# EAGLE design CHIP_tzatziffy_v6 (EAGLE 7.6.0)
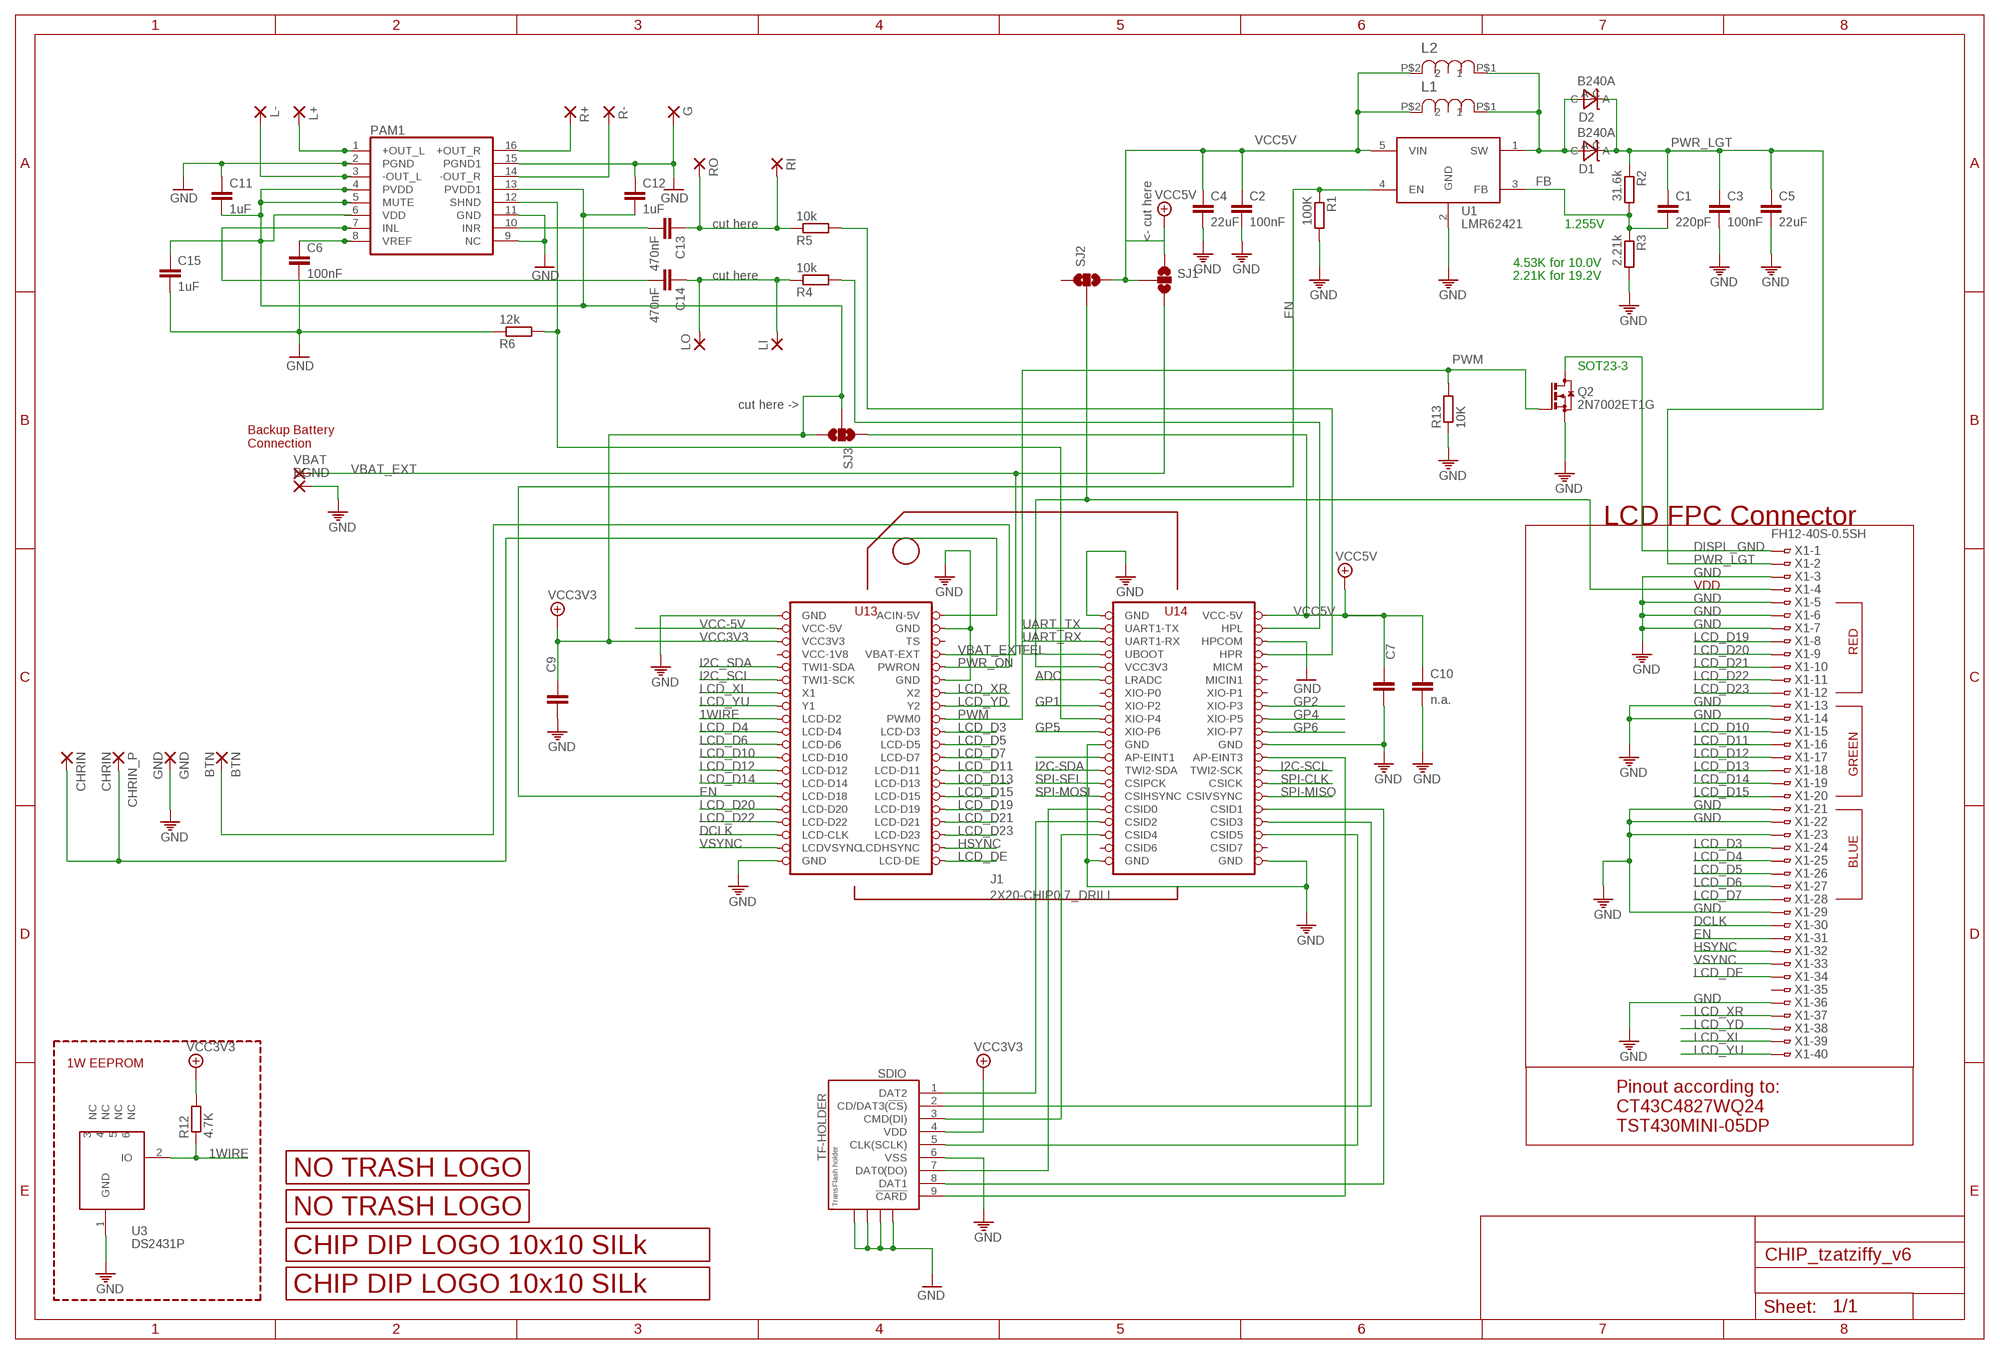
[diagram p0: schematic, sheet 1]

## Parts
BGND  1,6/0,8  [1,6/0,8]
BTN  BTN  SMD5  [SMD2,54-5,08]
C1  220pF  C-EUC0805  [C0805]
C2  100nF  C-EUC0805  [C0805]
C3  100nF  C-EUC0805  [C0805]
C4  22uF  C-EUC1206  [C1206]
C5  22uF  C-EUC1206  [C1206]
C6  100nF  C-EUC0805  [C0805]
C7  n.a.  C-EUC0805  [C0805]
C9  n.a.  C-EUC0805  [C0805]
C10  n.a.  C-EUC0805  [C0805]
C11  1uF  C-EUC0805  [C0805]
C12  1uF  C-EUC0805  [C0805]
C13  470nF  C-EUC0805  [C0805]
C14  470nF  C-EUC0805  [C0805]
C15  1uF  C-EUC0805  [C0805]
CHRIN  1,6/0,8  [1,6/0,8]
CHRIN_P  CHRIN  SMD5  [SMD2,54-5,08]
D1  B240A  DIODE_SCHTKY_B240  [DO-214AC]
D2  B240A  DIODE_SCHTKY_B240  [DO-214AC]
G  1,6/0,8  [1,6/0,8]
GND  GND  SMD5  [SMD2,54-5,08]
J1  2X20-CHIP0.7_DRILL  [2X20CHIP_NOOFFSET-TH_0.7]
L1  SRN6045-100M  [SRN6045]
L2  SRN6045-100M  [SRN6045]
L+  1,6/0,8  [1,6/0,8]
L-  1,6/0,8  [1,6/0,8]
LI  1,6/0,8  [1,6/0,8]
LO  1,6/0,8  [1,6/0,8]
PAM1  PAM8403  [SOP-16]
Q2  2N7002ET1G  BSS123  [SOT23]
R1  100K  R-EU_M0805  [M0805]
R2  31.6k  R-EU_M0805  [M0805]
R3  2.21k  R-EU_M0805  [M0805]
R4  10k  R-EU_R0805  [R0805]
R5  10k  R-EU_R0805  [R0805]
R6  12k  R-EU_R0805  [R0805]
R12  4.7K  R-EU_M0805  [M0805]
R13  10K  R-EU_M0805  [M0805]
R+  1,6/0,8  [1,6/0,8]
R-  1,6/0,8  [1,6/0,8]
RI  1,6/0,8  [1,6/0,8]
RO  1,6/0,8  [1,6/0,8]
SDIO  TF-HOLDER  [TF-PULL]
SJ1  SOLDERJUMPER_2WAYT  [SJ_2]
SJ2  SOLDERJUMPER_2WAYT  [SJ_2]
SJ3  SOLDERJUMPER_2WAYT  [SJ_2]
U1  LMR62421  [SOT23-5]
U3  DS2431P  [TSOC6]
U$2  LOGO_10X10_SILK  [LOGO2_10X10_SILK]
U$3  LOGO_NO_TRASHROHS  [LOGO_ROHS_SYM]
U$4  LOGO_NO_TRASHNO_TRASH  [LOGO_ROHS_NO_TRASH]
U$5  LOGO_10X10_SILK  [LOGO2_10X10_SILK]
VBAT  1,6/0,8  [1,6/0,8]
X1  FH12-40S-0.5SH  [FH12-40S-0.5SH]

## Nets
1WIRE: J1.LCD-D2 R12.1 U3.2(IO)
ADC: J1.LRADC
DCLK: J1.LCD-CLK X1.30
DISPL_GND: Q2.3(D) X1.1
EN: J1.LCD-D18 R1.1 U1.4(EN) X1.31
FB: C1.2 R2.2 R3.1 U1.3(FB)
FEL: J1.FEL(UBOOT)
GND: BGND.1(P) C2.2 C3.2 C4.2 C5.2 C6.2 C7.2 C9.2 C10.2 C11.1 C12.1 C15.2 G.1(P) GND.1(P) J1.GND@1(GND) J1.GND@2(GND) J1.GND@3(GND) J1.GND@4(GND) J1.GND@5(GND) J1.GND@6(GND) J1.GND@7(GND) J1.GND@8(GND) J1.GND@10(GND) J1.HPCOM PAM1.2(PGND) PAM1.9(NC) PAM1.11(GND) PAM1.15(PGND1) Q2.2(S) R1.2 R3.2 R6.1 R13.1 SDIO.6(VSS) SDIO.S1 SDIO.S2 SDIO.S3 SDIO.S4 U1.2(GND) U3.1(GND) X1.3 X1.5 X1.6 X1.7 X1.13 X1.14 X1.21 X1.22 X1.23 X1.29 X1.36
GP1: J1.XIO-P2
GP2: J1.XIO-P3
GP3: J1.XIO-P4 PAM1.12(SHND) R6.2
GP4: J1.XIO-P5
GP5: J1.XIO-P6
GP6: J1.XIO-P7
HSYNC: J1.LCD-HSYNC(LCDHSYNC) X1.32
I2C-SCL: J1.TWI2-SCK
I2C-SDA: J1.TWI2-SDA
I2C_SCL: J1.TWI1-SCK
I2C_SDA: J1.TWI1-SDA
KPD_INT: J1.AP-EINT1
LCD_D3: J1.LCD-D3 X1.24
LCD_D4: J1.LCD-D4 X1.25
LCD_D5: J1.LCD-D5 X1.26
LCD_D6: J1.LCD-D6 X1.27
LCD_D7: J1.LCD-D7 X1.28
LCD_D10: J1.LCD-D10 X1.15
LCD_D11: J1.LCD-D11 X1.16
LCD_D12: J1.LCD-D12 X1.17
LCD_D13: J1.LCD-D13 X1.18
LCD_D14: J1.LCD-D14 X1.19
LCD_D15: J1.LCD-D15 X1.20
LCD_D19: J1.LCD-D19 X1.8
LCD_D20: J1.LCD-D20 X1.9
LCD_D21: J1.LCD-D21 X1.10
LCD_D22: J1.LCD-D22 X1.11
LCD_D23: J1.LCD-D23 X1.12
LCD_DE: J1.LCD-DE X1.34
LCD_XL: J1.X1 X1.39
LCD_XR: J1.X2 X1.37
LCD_YD: J1.Y2 X1.38
LCD_YU: J1.Y1 X1.40
N$1: J1.CSID0 SDIO.7(DAT0(DO))
N$24: CHRIN.1(P) CHRIN_P.1(P) J1.CHG-IN(ACIN-5V)
N$25: J1.CSID4 SDIO.3(CMD(DI))
N$26: J1.VCC3V3@1(VCC3V3) SJ2.2 X1.4
N$27: J1.CSID1 SDIO.8(DAT1)
N$28: J1.CSID3 SDIO.2(CD/DAT3(!CS!))
N$31: J1.CSID2 SDIO.1(DAT2)
N$32: L+.1(P) PAM1.1(+OUT_L)
N$33: L-.1(P) PAM1.3(-OUT_L)
N$34: PAM1.16(+OUT_R) R+.1(P)
N$35: PAM1.14(-OUT_R) R-.1(P)
N$36: C14.2 PAM1.7(INL)
N$37: J1.HPR R5.2
N$38: C6.1 PAM1.8(VREF)
N$39: C13.2 PAM1.10(INR)
N$40: J1.HPL R4.2
N$41: C14.1 LI.1(P) LO.1(P) R4.1
N$43: C13.1 R5.1 RI.1(P) RO.1(P)
N$44: J1.CSID5 SDIO.5(CLK(SCLK))
N$45: J1.AP-EINT3 SDIO.9(!CARD)
PWM: J1.PWM0 Q2.1(G) R13.2
PWR_LGT: C1.1 C3.1 C5.1 D1.C D2.C R2.1 X1.2
PWR_ON: BTN.1(P) J1.PWRON
SPI-CLK: J1.CSICK
SPI-MISO: J1.CSIVSYNC
SPI-MOSI: J1.CSIHSYNC
SPI-SEL: J1.CSIPCK
UART_RX: J1.UART1-RX
UART_TX: J1.UART1-TX
VBAT_EXT: J1.BAT(VBAT-EXT) SJ1.3 VBAT.1(P)
VCC3V3: C9.1 C11.2 C12.2 C15.1 J1.VCC3V3 PAM1.4(PVDD) PAM1.5(MUTE) PAM1.6(VDD) PAM1.13(PVDD1) R12.2 SDIO.4(VDD) SJ3.2 SJ3.3
VCC5V: C2.1 C4.1 C7.1 C10.1 J1.VCC5V@1(VCC-5V) L1.P$2 L2.P$2 SJ1.1 SJ1.2 SJ2.3 SJ3.1 U1.5(VIN)
VCC-5V: J1.VCC5V@0(VCC-5V)
VREG_OUTPUT: D1.A D2.A L1.P$1 L2.P$1 U1.1(SW)
VSYNC: J1.LCD-VSYNC(LCDVSYNC) X1.33
Unconnected: J1.CSID6 J1.CSID7 J1.MICIN1 J1.MICM J1.TS J1.XIO-P0 J1.XIO-P1 SJ2.1 U3.3(NC) U3.4(NC) U3.5(NC) U3.6(NC) X1.35

## Notes on the sheet
- cut here | 1.255V
- <- cut here
- 4.53K for 10.0V
- cut here | 2.21K for 19.2V
- SOT23-3
- cut here ->
- Backup Battery
  Connection
- LCD FPC Connector
- VDD
- RED
- GREEN
- BLUE
- 1W EEPROM
- Pinout according to:
  CT43C4827WQ24
  TST430MINI-05DP

## Power pins joined to a net without a drawn wire
VCC-1V8: J1.VCC1V8(VCC-1V8)

## Library data of the parts
BGND CHRIN G L+ L- LI LO R+ R- RI RO VBAT = wirepad:1,6/0,8: THROUGH-HOLE PAD
BTN CHRIN_P GND = wirepad:SMD5: SMD PAD
C1-C7 C9-C15 = rcl:C-EU: CAPACITOR, European symbol
D1 D2 = Keyboard v0_5:DIODE_SCHTKY_B240; DESCRIPTION: DIODE SMD General Purpose 400V 1A 1.4W RoHS DO-214AC; FOOTPRINT: DO-214AC; LINK: http://www.digikey.com/product-detail/en/B240A-13-F/B240A-FDICT-ND/717810; MFG: DIGIKEY; MFG_PN: B240A-FDICT-ND; PART_TYPE: DIODE; PRICE: 0.11; VENDOR: DIODES; VENDOR_PART_NUMBER: B240A-13-F
J1 = JKW_CHIP:2X20-CHIP: Through hole layout with chip reference
L1 L2 = Keyboard v0_5:SRN6045-100M; DESCRIPTION: power inductor 10uH 2.5A 58.6 mohm; FOOTPRINT: SRN6045; LINK: http://www.digikey.com/product-detail/en/SRN6045-100M/SRN6045-100MTR-ND/2756120; MFG: DIGIKEY; MFG_PN: SRN6045-100MTR-ND; PART_TYPE: IND; PRICE: 0.15; TOLLERANCE: ±20%; VENDOR: BOURNS; VENDOR_PART_NUMBER: SRN6045-100M
PAM1 = JKW_CHIP:PAM8403: Dual channel audio amplifier IC - PAM8403
Q2 = transistor-small-signal:BSS123: N-CHANNEL MOS FET
R1-R6 R12 R13 = rcl:R-EU_: RESISTOR, European symbol
SDIO = JKW_CHIP:TF-HOLDER: TF / Micro SD socket is PUSH-PUSH type, the card can be pushed into and auto locked and pushed out by simply press the card. Surface Mounting type.
SJ1-SJ3 = SparkFun-Retired:SOLDERJUMPER_2WAY: Solder Jumper 2 way solder jumper
U1 = PocketCHIP-Components-v0.7:LMR62421; DESCRIPTION: dc/dc step up, 2.1A, 1.6mhz, SOT-23-5; FOOTPRINT: SOT23-5; LINK: http://www.digikey.com/product-detail/en/LMR62421XMFE%2FNOPB/LMR62421XMFE%2FNOPBCT-ND/2777085; MFG: DIGIKEY; MFG_PN: LMR62421XMFE/NOPBCT-ND; PART_TYPE: IC; PRICE: 0.8; VENDOR: TEXAS INSTRUMENTS; VENDOR_PART_NUMBER: LMR62421XMFE/NOPB
U3 = Keyboard v0_5:DS2431: 1024-Bit EEPROM This chip provides a 4x256 Bit EEPROM, which can be programmed@5V. Write protection and OTP emulation are available, too. Author: Jan Kandziora <jjj@gmx.de>; DESCRIPTION: IC, 1024-Bit, 1-Wire EEPROM, TSOC6; FOOTPRINT: TSOC6; LINK: http://www.digikey.com/product-detail/en/DS2431P%2BT%26R/DS2431P%2BT%26RCT-ND/3647900; MFG: DIGIKEY; MFG_PN: DS2431P+T&RCT-ND; PART_TYPE: IC; PRICE: 0.98; VENDOR: MAXIM; VENDOR_PART_NUMBER: DS2431P+T&R
U$2 U$5 = JKW_CHIP:LOGO_10X10_SILK
U$3 U$4 = JKW_CHIP:LOGO_NO_TRASH
X1 = Keyboard v0_5:FH12-40S-0.5S: 0.5mm Pitch Connectors For FPC/FFC Source: Data sheet <http://www.hirose.co.jp/cataloge_hp/e58605370.pdf>; DESCRIPTION: CON ffc smd, bottom contact 40pos, 0.50mm R/A; FOOTPRINT: FH12-40S-0.5SH; LINK: http://www.digikey.com/product-detail/en/FH12-40S-0.5SH(55)/HFJ140CT-ND/1110388; MFG: DIGIKEY; MFG_PN: HFJ140CT-ND; VENDOR: HIROSE; VENDOR_PART_NUMBER: FH12-40S-0.5SH(55)

## Board
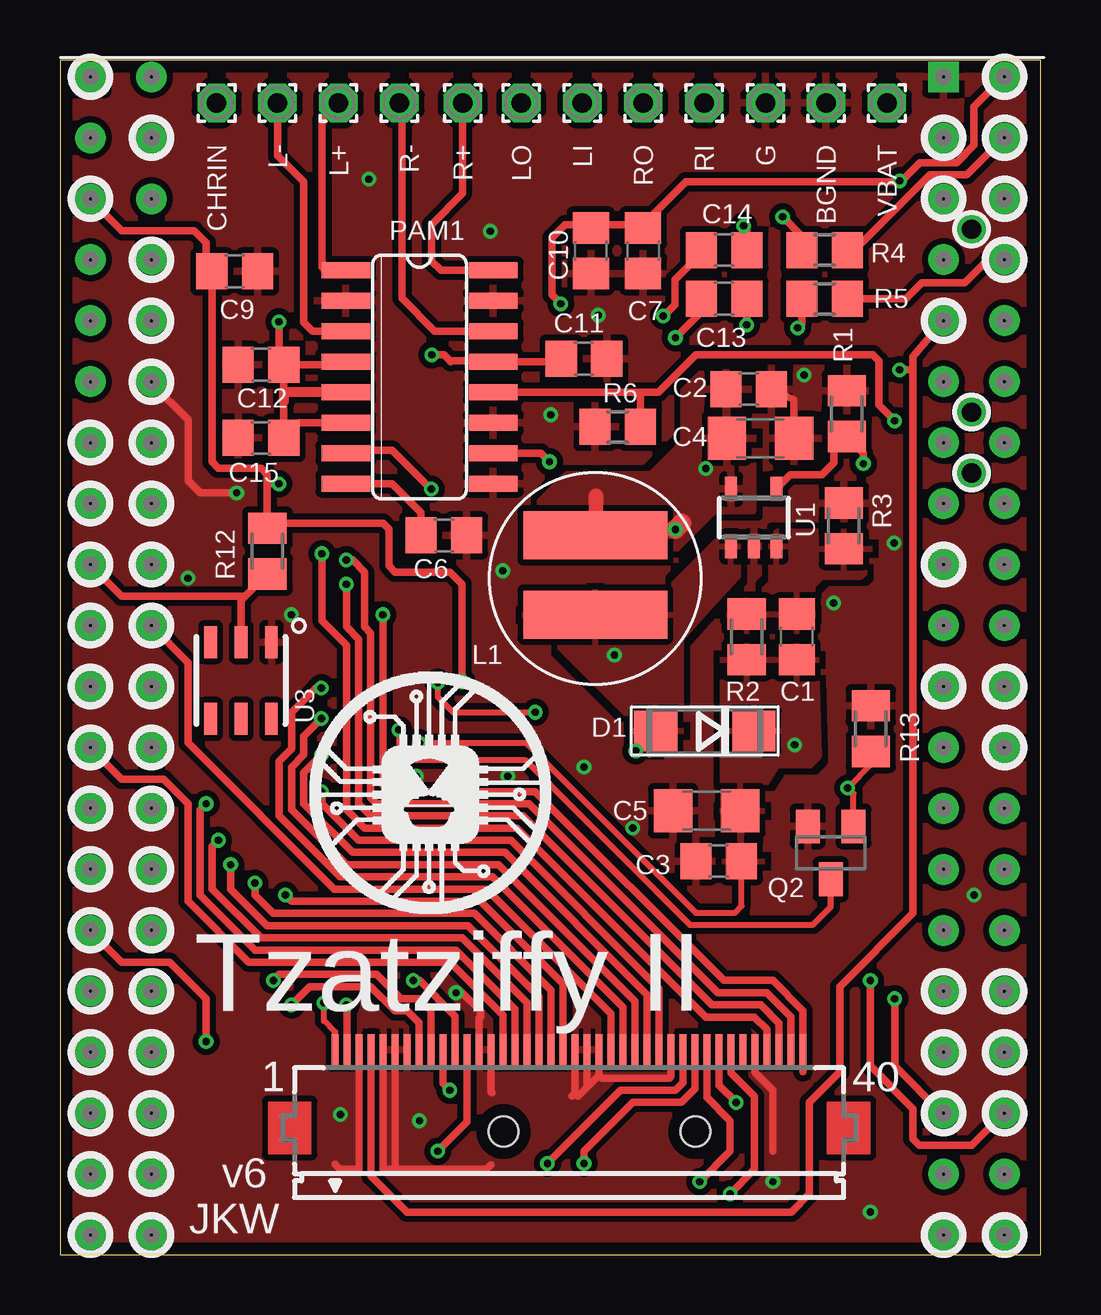
[diagram p1: board, top side]
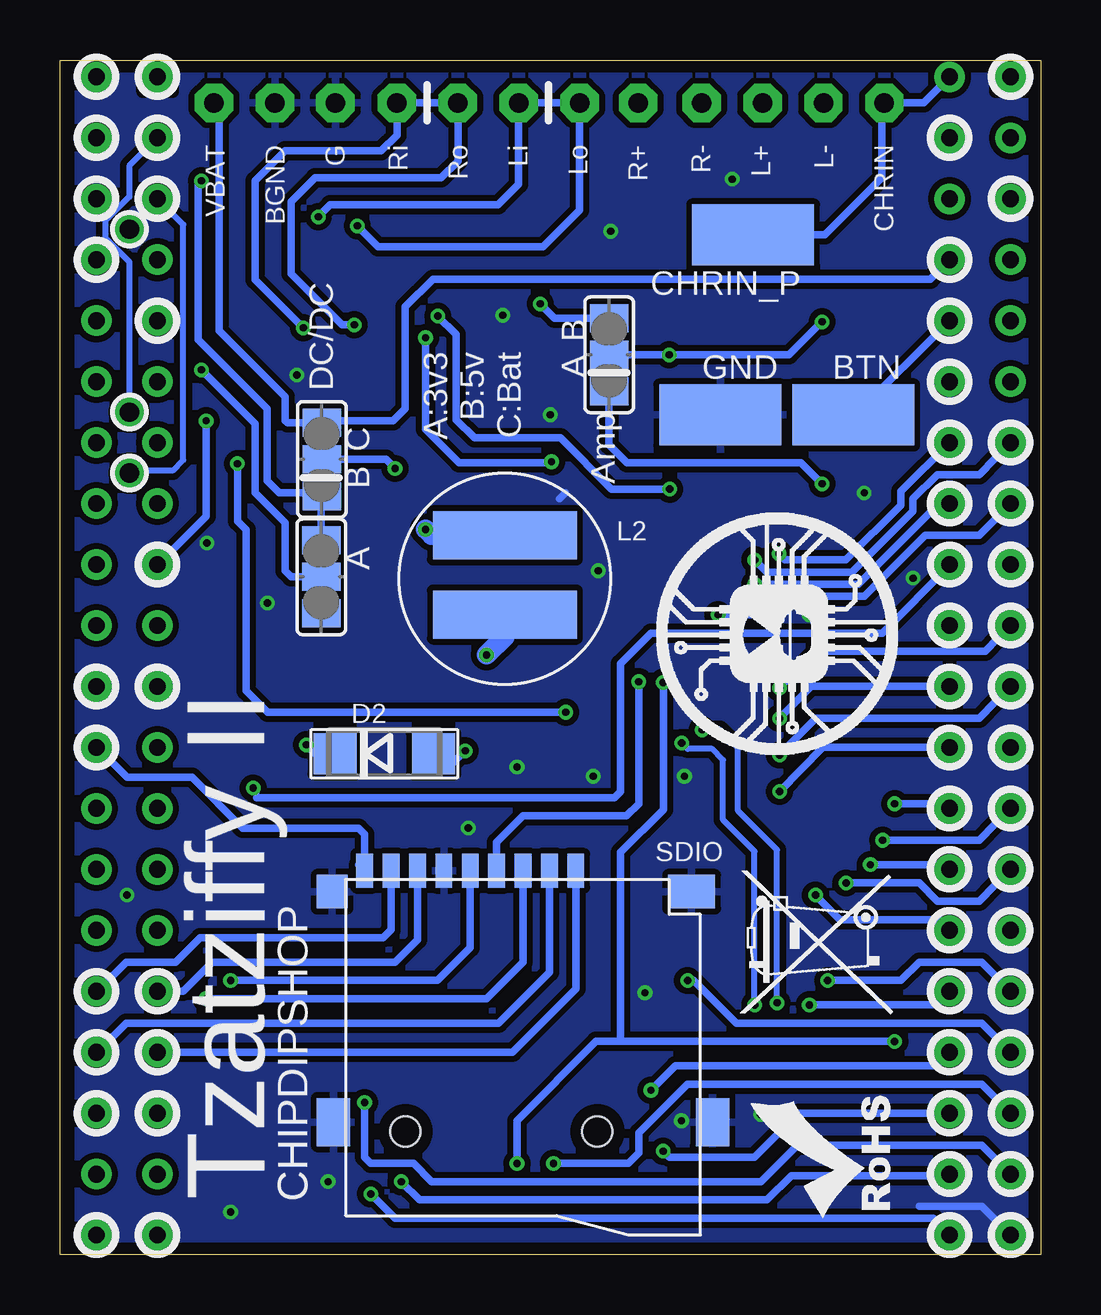
[diagram p2: board, bottom side, seen from below]

Size 40.89 x 49.78 mm. Coordinates in mm from the lower left corner, seen from the top.
Outline: 0,0 40.89,0 40.89,49.78 0,49.78 0,0
Copper layers (1*16): Top 0.035mm / dielectric 1.6mm / Bottom 0.035mm
Design rules "Elecrow_2-layer_PCB_eagle_rule": minimum track width 6mil, minimum drill 12mil, track to track 6mil, track to pad 6mil, pad to pad 6mil, via to via 8mil, smd to smd 0mil, copper to edge 20mil, drill to drill 10mil, minimum pad ring 6mil, minimum via ring 6mil, stop-mask expansion 0mil, vias tented up to drill 100mil, thermal gap 10mil

### Footprints (pad centres in the part's own frame; a part is rotated, then mirrored left to right if it is on the bottom)
1,6/0,8 = drill 0.813 pad 1.6 octagon: 1 0,0
SMD2,54-5,08 = smd 2.54 x 5.08: 1 0,0
C0805 = smd 1.3 x 1.5: 1 -0.95,0; 2 0.95,0
C1206 = smd 1.6 x 1.8: 1 -1.4,0; 2 1.4,0
DO-214AC = smd 1.8 x 1.7: A 2.05,0; C -2.05,0
2X20CHIP_NOOFFSET-TH_0.7 = drill 0.7 pad 1.27: AP-EINT1 15.22,-3.75; AP-EINT3 17.76,-3.75; BAT -17.8,16.57; CHG-IN -17.8,24.19; CSICK 17.76,-8.83; CSID0 15.22,-13.91; CSID1 17.76,-13.91; CSID2 15.22,-16.45; CSID3 17.76,-16.45; CSID4 15.22,-18.99; CSID5 17.76,-18.99; CSID6 15.22,-21.53; CSID7 17.76,-21.53; CSIHSYNC 15.22,-11.37; CSIPCK 15.22,-8.83; CSIVSYNC 17.76,-11.37; FEL 15.22,16.57; GND@1 -17.8,11.49; GND@2 -20.34,-24.07; GND@4 17.76,-1.21; GND@5 17.76,-24.07; GND@6 15.22,-24.07; GND@7 15.22,-1.21; GND@10 -17.8,21.65; HPCOM 17.76,19.11; HPL 17.76,21.65; HPR 17.76,16.57; LCD-CLK -20.34,-18.99; LCD-D2 -20.34,3.87; LCD-D3 -17.8,1.33; LCD-D4 -20.34,1.33; LCD-D5 -17.8,-1.21; LCD-D6 -20.34,-1.21; LCD-D7 -17.8,-3.75; LCD-D10 -20.34,-3.75; LCD-D11 -17.8,-6.29; LCD-D12 -20.34,-6.29; LCD-D13 -17.8,-8.83; LCD-D14 -20.34,-8.83; LCD-D15 -17.8,-11.37; LCD-D18 -20.34,-11.37; LCD-D19 -17.8,-13.91; LCD-D20 -20.34,-13.91; LCD-D21 -17.8,-16.45; LCD-D22 -20.34,-16.45; LCD-D23 -17.8,-18.99; LCD-DE -17.8,-24.07; LCD-HSYNC -17.8,-21.53; LCD-VSYNC -20.34,-21.53; LRADC 15.22,11.49; MICIN1 17.76,11.49; MICM 17.76,14.03; PWM0 -17.8,3.87; PWRON -17.8,14.03; TS -17.8,19.11; TWI1-SCK -20.34,11.49; TWI1-SDA -20.34,14.03; TWI2-SCK 17.76,-6.29; TWI2-SDA 15.22,-6.29; UART1-RX 15.22,19.11; UART1-TX 15.22,21.65; VCC1V8 -20.34,16.57; VCC3V3 -20.34,19.11; VCC3V3@1 15.22,14.03; VCC5V@0 -20.34,21.65; VCC5V@1 17.76,24.19; X1 -20.34,8.95; X2 -17.8,8.95; XIO-P0 15.22,8.95; XIO-P1 17.76,8.95; XIO-P2 15.22,6.41; XIO-P3 17.76,6.41; XIO-P4 15.22,3.87; XIO-P5 17.76,3.87; XIO-P6 15.22,1.33; XIO-P7 17.76,1.33; Y1 -20.34,6.41; Y2 -17.8,6.41 | drill 0.7 pad 1.27 square: GND@3 -20.34,24.19; GND@8 15.22,24.19
SRN6045 = smd 2 x 6: P$1 1.5,0; P$2 -1.8,0
SOP-16 = smd 0.66 x 2.032: 1 -4.445,-3.073; 2 -3.175,-3.073; 3 -1.905,-3.073; 4 -0.635,-3.073; 5 0.635,-3.073; 6 1.905,-3.073; 7 3.175,-3.073; 8 4.445,-3.073; 9 4.445,3.073; 10 3.175,3.073; 11 1.905,3.073; 12 0.635,3.073; 13 -0.635,3.073; 14 -1.905,3.073; 15 -3.175,3.073; 16 -4.445,3.073
SOT23 = smd 1 x 1.4: 1 -0.95,-1.1; 2 0.95,-1.1; 3 0,1.1
M0805 = smd 1.3 x 1.6: 1 -0.95,0; 2 0.95,0
R0805 = smd 1.3 x 1.5: 1 -0.95,0; 2 0.95,0
TF-PULL = smd 0.7 x 1.4: 1 -2.2,-7.62; 2 -1.1,-7.62; 3 0,-7.62; 4 1.1,-7.62; 5 2.2,-7.62; 6 3.3,-7.62; 7 4.4,-7.62; 8 5.5,-7.62; 9 6.6,-7.62 | smd 1.4 x 2: S1 -7.9,2.85; S2 7.9,2.85 | smd 1.28 x 1.4: S3 7.96,-6.75 | smd 1.95 x 1.4: S4 -7.025,-6.75 | hole 1.25: -3.1,3.25; 4.9,3.25
SJ_2 = smd 1.168 x 1.6: 1 -1.524,0; 2 0,0; 3 1.524,0
SOT23-5 = smd 0.5 x 1: 1 -0.95,-1.2; 2 0,-1.2; 3 0.95,-1.2; 4 0.95,1.2; 5 -0.95,1.2
TSOC6 = smd 0.53 x 1.33: 1 -1.27,-1.6; 2 0,-1.6; 3 1.27,-1.6; 4 1.27,1.6; 5 0,1.6; 6 -1.27,1.6
FH12-40S-0.5SH = smd 0.3 x 1.3: 1 -9.75,3.25; 2 -9.25,3.25; 3 -8.75,3.25; 4 -8.25,3.25; 5 -7.75,3.25; 6 -7.25,3.25; 7 -6.75,3.25; 8 -6.25,3.25; 9 -5.75,3.25; 10 -5.25,3.25; 11 -4.75,3.25; 12 -4.25,3.25; 13 -3.75,3.25; 14 -3.25,3.25; 15 -2.75,3.25; 16 -2.25,3.25; 17 -1.75,3.25; 18 -1.25,3.25; 19 -0.75,3.25; 20 -0.25,3.25; 21 0.25,3.25; 22 0.75,3.25; 23 1.25,3.25; 24 1.75,3.25; 25 2.25,3.25; 26 2.75,3.25; 27 3.25,3.25; 28 3.75,3.25; 29 4.25,3.25; 30 4.75,3.25; 31 5.25,3.25; 32 5.75,3.25; 33 6.25,3.25; 34 6.75,3.25; 35 7.25,3.25; 36 7.75,3.25; 37 8.25,3.25; 38 8.75,3.25; 39 9.25,3.25; 40 9.75,3.25

### Placement (x,y rotation side)
BGND  31.93,48 0 top
BTN  7.83,35 270 bottom
C1  30.71,25.75 90 top
C2  28.71,36.08 0 top
C3  27.46,16.41 180 top
C4  29.2,34.03 0 top
C5  26.96,18.5 180 top
C6  16,29.97 0 top
C7  24.31,41.84 270 top
C9  7.29,40.98 0 top
C10  22.13,41.84 270 top
C11  21.84,37.34 180 top
C12  8.38,37.08 0 top
C13  27.69,39.83 180 top
C14  27.69,41.87 180 top
C15  8.38,34.04 180 top
CHRIN  6.53,48 270 top
CHRIN_P  12,42.5 90 bottom
D1  26.88,21.83 180 top
D2  27.38,20.88 0 bottom
G  29.41,48 0 top
GND  13.37,35 270 bottom
J1  21.61,24.89 0 top
L1  22.32,28.18 270 top
L2  22.35,28.17 270 bottom
L+  11.61,48 0 top
L-  9.07,48 0 top
LI  21.77,48 0 top
LO  19.23,48 0 top
PAM1  14.99,36.58 270 top
Q2  32.12,16.75 180 top
R1  32.8,35.05 90 top
R2  28.63,25.75 90 top
R3  32.67,30.38 90 top
R4  31.88,41.87 0 top
R5  31.88,39.83 0 top
R6  23.25,34.5 0 top
R12  8.65,29.32 90 top
R13  33.8,21.93 270 top
R+  16.79,48 0 top
R-  14.15,48 0 top
RI  26.85,48 0 top
RO  24.31,48 0 top
SDIO  21.59,8.38 180 bottom
SJ1  29.98,33.14 90 bottom
SJ2  30,28.25 90 bottom
SJ3  18,37.5 270 bottom
U1  28.92,30.72 0 top
U3  7.55,23.93 180 top
U$2  10.41,14.22 0 top
U$3  6.21,1.08 90 bottom
U$4  6.17,10.02 90 bottom
U$5  5.97,20.85 90 bottom
VBAT  34.47,48 0 top
X1  21.22,5.29 0 top

### Tracks (layer width: path | path; a pad name or v marks a point on that pad's centre or on a via)
1WIRE
  Top 0.305: J1.LCD-D2 2.58,27.43 7.71,27.43 | 7.71,27.43 R12.1 | U3.2 7.55,27.27 7.71,27.43
DCLK  (via drill 0.3)
  Top 0.305: X1.30 25.97,7.18 25.65,6.86 23.37,6.86 v20.32,3.81
  Bottom 0.305: J1.LCD-CLK 2.46,7.11 14.73,7.11 16.75,5.09 16.75,4.25 17.19,3.81 v20.32,3.81
DISPL_GND  (via drill 0.3)
  Top 0.254: X1.1 11.47,9.28 11,9.75 v11,10.5 | v14.12,21.88 14.12,20.88 14.38,20.62 19.38,20.62 26.25,13.75 31.38,13.75 32.12,14.5 Q2.3
  Bottom 0.254: v11,10.5 11,16.88 12.62,18.5 12.62,21.12 13.38,21.88 v14.12,21.88
EN  (via drill 0.3)
  Top 0.254: v15.75,23.85 15.75,23.25 16.39,22.61 v19.81,22.61
  Top 0.305: J1.LCD-D18 2.58,12.19 4.57,12.19 6.1,10.67 v6.1,8.89 | X1.31 26.47,6.91 25.91,6.35 23.88,6.35 21.84,4.32 v21.84,3.81 | U1.4 30.45,32.5 31.75,32.5 32.25,33 32.25,33.55 R1.1 33.49,33.41 v33.49,32.96
  Bottom 0.305: v6.1,8.89 17.53,8.89 | v15.75,23.85 15.75,18.54 17.53,16.76 17.53,8.89 | 17.53,8.89 18.54,8.89 21.84,5.59 v21.84,3.81 | v19.81,22.61 32.23,22.61 33.12,23.5 33.12,30.21 33.49,30.57 v33.49,32.96
FB
  pour Top: 27.88,26.12 28,26 31.38,26 31.38,27.88 31.75,28.25 32.62,28.25 33.38,28.25 33.75,28.62 33.75,30 33.62,30.12 29.88,30.12 29.62,29.88 29.62,28 28.88,27.25 28,27.25 27.88,27.12 27.88,26.25
GND  (via drill 0.3, 0.8)
  Top 0.305: 13.97,3.56 17.78,3.56 17.97,3.75 | PAM1.2 12.04,39.88 | v7.37,31.75 5.84,31.75 5.33,32.26 5.33,34.8 3.81,36.32 | 11.47,3.77 11.68,3.56 12.45,3.56 12.47,3.58 X1.3 | 13.97,3.56 13.46,3.56 13.47,3.57 X1.5 | X1.6 13.97,3.56 | X1.36 28.97,7.6 29.72,6.86 29.72,4.32 | 16.76,10.92 17.53,10.16 17.53,9.91 17.47,9.85 X1.13 | X1.29 25.47,7.44 25.4,7.37 22.59,7.37 22.47,7.49 | X1.21 21.47,6.74 21.34,6.6 | X1.23 22.47,7.49 | 22.47,7.49 21.97,6.99 | 21.97,6.99 21.59,6.6 | X1.22 21.97,6.99 | X1.14 17.97,6.78 18,6.75 | C2.2 30.6,35.63 C4.2
  Bottom 0.305: J1.GND@2 2.46,2.03 5.08,2.03 | 20.07,31.5 19.81,31.75
  other vias: 22.44,39.15 18.46,28.5 9.65,26.67 5.33,28.19 12.87,44.82 21.84,20.32 34.77,29.66 33.78,1.78 29.72,3.05 23.88,17.78 38.1,14.99 18.67,19.94 14.86,19.94 14.99,5.59 16.51,10.92 11.68,5.84 17.94,42.65 38,42.73 32.25,27.16 31.02,36.66 20.46,35
  pour Bottom (isolate 0.254, rank 3): 0.51,49.78 40.13,49.78 40.13,0.25 0.51,0.25
  pour Top (isolate 0.254, rank 3): 0.51,49.78 40.13,49.78 40.13,0.25 0.51,0.25
GP3  (via drill 0.3)
  Top 0.305: 34.55,35 v34.8,34.75 34.12,35.42 34.12,37.25 33.88,37.5 26.5,37.5 24.94,35.94 24.25,35.94 | PAM1.12 24.25,35.94 | R6.2 24.2,35.89 24.25,35.94
  Bottom 0.305: v34.8,34.75 34.8,30.77 J1.XIO-P4
HSYNC  (via drill 0.3)
  Top 0.305: 26.97,3.35 v26.67,3.05 27.94,4.31 27.94,5.59 26.97,6.56 X1.32
  Bottom 0.305: J1.LCD-HSYNC 3.85,3.3 10.41,3.3 11.43,2.29 25.91,2.29 v26.67,3.05
LCD_D3
  Top 0.305: J1.LCD-D3 5.33,24.68 5.33,21.34 11.43,15.24 17.78,15.24 22.97,10.05 X1.24
  Bottom 0.305: 3.85,26.16 J1.LCD-D3
LCD_D4  (via drill 0.3)
  Top 0.305: X1.25 23.47,10.31 18.03,15.75 11.68,15.75 9.14,18.29 9.14,20.57 9.65,21.08 9.65,22.61 10.67,23.62 v10.9,23.62
  Bottom 0.305: J1.LCD-D4 2.33,25.15 9.38,25.15 v10.9,23.62
LCD_D5  (via drill 0.3)
  Top 0.305: X1.26 23.97,10.57 18.29,16.26 11.94,16.26 9.65,18.54 9.65,20.32 10.16,20.83 10.16,21.61 v10.9,22.35
  Bottom 0.305: J1.LCD-D5 9.57,23.68 v10.9,22.35
LCD_D6  (via drill 0.3)
  Top 0.305: X1.27 24.47,10.83 18.54,16.76 12.19,16.76 10.16,18.8 10.16,20.09 v10.9,20.83
  Bottom 0.305: J1.LCD-D6 2.58,22.35 9.38,22.35 v10.9,20.83
LCD_D7  (via drill 0.3)
  Top 0.305: X1.28 24.97,11.1 18.8,17.27 12.45,17.27 10.92,18.8 v10.9,19.3
  Bottom 0.305: J1.LCD-D7 9.08,21.14 v10.9,19.3
LCD_D10
  Top 0.305: J1.LCD-D10 2.58,19.81 4.32,19.81 5.33,18.8 5.33,14.73 7.87,12.19 16.26,12.19 18.47,9.98 X1.15
LCD_D11  (via drill 0.3)
  Top 0.305: v6.1,18.8 5.84,18.54 5.84,14.99 8.13,12.7 16.51,12.7 18.97,10.24 X1.16
  Bottom 0.305: v6.1,18.8 3.98,18.8 J1.LCD-D11
LCD_D12  (via drill 0.3)
  Top 0.305: v6.6,17.27 6.35,17.02 6.35,15.24 8.38,13.21 16.76,13.21 19.47,10.5 X1.17
  Bottom 0.305: J1.LCD-D12 2.58,17.27 v6.6,17.27
LCD_D13  (via drill 0.3)
  Top 0.305: v7.11,16.26 7.11,15.24 8.64,13.72 17.02,13.72 19.97,10.76 X1.18
  Bottom 0.305: v7.11,16.26 3.98,16.26 J1.LCD-D13
LCD_D14  (via drill 0.3)
  Top 0.305: X1.19 20.47,11.02 17.27,14.22 8.89,14.22 8.13,14.99 v8.13,15.49
  Bottom 0.305: J1.LCD-D14 2.58,14.73 4.32,14.73 5.08,15.49 v8.13,15.49
LCD_D15  (via drill 0.3)
  Top 0.305: X1.20 20.97,11.29 17.53,14.73 9.65,14.73 v9.4,14.99
  Bottom 0.305: v9.4,14.99 8.38,13.97 4.24,13.97 J1.LCD-D15
LCD_D19  (via drill 0.3)
  Top 0.305: X1.8 14.97,9.67 14.48,10.16 13.97,10.16 12.95,11.18 10.41,11.18 v9.65,10.41
  Bottom 0.305: v9.65,10.41 4.36,10.41 J1.LCD-D19
LCD_D20  (via drill 0.3)
  Top 0.305: X1.9 15.47,10.18 14.99,10.67 14.22,10.67 13.21,11.68 9.14,11.68 v8.89,11.43
  Bottom 0.305: J1.LCD-D20 2.46,12.19 5.08,12.19 5.84,11.43 v8.89,11.43
LCD_D21  (via drill 0.3)
  Top 0.305: v16.26,6.86 15.97,7.14 X1.10
  Bottom 0.305: J1.LCD-D21 4.36,7.87 15.24,7.87 v16.26,6.86
LCD_D22  (via drill 0.3)
  Top 0.305: X1.11 16.47,9.94 14.99,11.43 v14.73,11.43
  Bottom 0.305: J1.LCD-D22 2.46,9.65 12.7,9.65 14.48,11.43 v14.73,11.43
LCD_D23  (via drill 0.3)
  Top 0.305: 16.97,8.17 X1.12 16.97,5.54 v15.75,4.32
  Bottom 0.305: J1.LCD-D23 10.1,5.9 11.94,4.06 15.49,4.06 v15.75,4.32
LCD_DE  (via drill 0.3)
  Top 0.305: X1.34 27.97,7.59 28.96,6.6 28.96,3.56 v27.94,2.54
  Bottom 0.305: J1.LCD-DE 4.49,1.52 26.92,1.52 v27.94,2.54
LCD_XL  (via drill 0.3)
  Top 0.305: v11.94,28.96 12.19,28.96 12.7,28.45 12.7,26.16 12.95,25.91 12.95,19.05 13.21,18.8 19.56,18.8 27.43,10.92 29.46,10.92 30.47,9.91 X1.39
  Bottom 0.305: J1.X1 2.58,32.51 4.32,32.51 5.33,31.5 5.33,30.99 7.87,28.45 11.43,28.45 v11.94,28.96
LCD_XR  (via drill 0.3)
  Top 0.305: v10.92,29.21 10.92,26.42 11.94,25.4 11.94,18.54 12.7,17.78 19.05,17.78 26.92,9.91 28.96,9.91 29.47,9.39 X1.37
  Bottom 0.305: v10.92,29.21 10.67,28.96 8.13,28.96 5.84,31.24 5.84,31.81 J1.X2
LCD_YD  (via drill 0.3)
  Top 0.305: v11.94,27.94 11.94,26.16 12.45,25.65 12.45,18.8 12.95,18.29 19.3,18.29 27.18,10.41 29.21,10.41 29.97,9.65 X1.38
  Bottom 0.305: J1.Y2 3.85,31.24 4.32,31.24 7.62,27.94 v11.94,27.94
LCD_YU  (via drill 0.3)
  Top 0.305: 30.97,7.64 X1.40 30.97,10.18 29.72,11.43 27.69,11.43 19.81,19.3 13.72,19.3 13.46,19.56 v13.46,26.67
  Bottom 0.305: J1.Y1 2.58,29.97 4.83,29.97 7.37,27.43 10.67,27.43 11.43,26.67 v13.46,26.67
N$1
  Bottom 0.305: SDIO.7 25.99,13.13 26.92,12.19 34.54,12.19 35.75,10.98 J1.CSID0
N$24
  Bottom 0.305: CHRIN_P.1 9,42.5 6.62,44.88 6.62,47.91 CHRIN.1 4.89,48 J1.CHG-IN
N$25  (via drill 0.3)
  Top 0.305: v34.8,10.67 34.8,7.87 36.77,5.9 J1.CSID4
  Bottom 0.305: SDIO.3 21.59,12.19 23.11,10.67 v34.8,10.67
N$26  (via drill 0.3)
  Top 0.305: J1.VCC3V3@1 35.56,37.42 35.56,36.88 | 35.56,36.88 35.56,14.22 32.51,11.18 32.51,7.62 31.24,6.35 31.24,2.54 30.48,1.78 14.48,1.78 12.97,3.28 X1.4 | v35,36.88 35.56,36.88
  Bottom 0.305: SJ2.2 31.25,28.25 31.5,28.5 31.5,30.5 32.75,31.75 32.75,34.62 v35,36.88
N$27
  Bottom 0.305: SDIO.8 27.09,13.55 27.43,13.21 35.05,13.21 36.07,12.19 38.14,12.19 J1.CSID1
N$28
  Bottom 0.305: SDIO.2 20.49,11.77 22.61,9.65 38.14,9.65 J1.CSID3
N$31
  Bottom 0.305: SDIO.1 19.39,11.09 22.04,8.44 J1.CSID2
N$32
  Top 0.305: PAM1.1 11.79,40.89 11.18,40.89 10.92,41.15 10.92,47.31 L+.1
N$33
  Top 0.305: PAM1.3 10.54,38.48 10.16,38.86 10.16,44.7 9.07,45.79 L-.1
N$34
  Top 0.305: PAM1.16 15.88,41.02 15.49,41.4 15.49,42.93 16.79,44.22 R+.1
N$35
  Top 0.305: PAM1.14 15.62,38.48 14.25,39.85 14.25,47.9 R-.1
N$36  (via drill 0.3)
  Top 0.305: PAM1.7 12.04,33.53 13.85,33.53 v15.47,31.9 | C14.2 26.74,41.74 25.62,40.62 25.62,39.59 v25.15,39.12
  Bottom 0.305: v25.15,39.12 24.38,38.35 24.38,34.8 23.62,34.04 20.04,34.04 17.9,31.9 v15.47,31.9
N$37
  Top 0.305: J1.HPR 38.67,41.46 37.71,40.51 35.94,40.51 35.26,39.83 R5.2
N$38
  Top 0.305: PAM1.8 13.84,32.13 15.05,30.92 C6.1
N$39  (via drill 0.3)
  Top 0.305: PAM1.10 20.05,33.4 v20.4,33.04 | C13.2 26.74,39.3 v25.65,38.21
  Bottom 0.305: v25.65,38.21 25.65,34.4 24.25,33 20.45,33 v20.4,33.04
N$40
  Top 0.305: J1.HPL 38.1,45.29 37.81,45 36.25,45 33.12,41.87 R4.2
N$41  (via drill 0.3)
  Top 0.305: C14.1 28.64,42.73 v28.5,42.88 | R4.1 30.93,42.45 v30.12,43.25
  Bottom 0.305: v28.5,42.88 27.62,42 20.75,42 19.23,43.52 LO.1 LI.1 21.77,44.6 22.62,43.75 29.62,43.75 v30.12,43.25
N$43  (via drill 0.3)
  Top 0.305: C13.1 28.64,38.77 v28.62,38.75 | R5.1 30.93,38.8 v30.75,38.62
  Bottom 0.305: v28.62,38.75 29.12,38.75 31.25,40.88 31.25,43.88 30.25,44.88 25,44.88 24.31,45.56 RO.1 RI.1 26.85,46.65 27.5,46 31.5,46 32.75,44.75 32.75,40.62 v30.75,38.62
N$44  (via drill 0.3)
  Top 0.305: J1.CSID5 38.02,4.57 35.81,4.57 35.56,4.83 35.56,6.1 33.78,7.87 v33.78,11.43
  Bottom 0.305: SDIO.5 23.79,12.79 25.15,11.43 v33.78,11.43
N$45
  Bottom 0.305: 28.45,16.26 SDIO.9 28.19,17.53 28.45,17.78 33.27,17.78 35.39,19.89 38.1,19.89 J1.AP-EINT3
PWM  (via drill 0.3)
  Top 0.254: Q2.1 33.08,19.21 v32.84,19.45 33.8,20.41 R13.2
  Bottom 0.254: 32.69,19.05 32.69,19.3 v32.84,19.45
  Bottom 0.305: J1.PWM0 3.79,28.72 6.6,25.91 16.26,25.91 17.53,24.64 17.53,19.3 17.78,19.05 32.69,19.05
PWR_LGT  (via drill 0.3)
  Top 0.254: v14.98,21.33 19.42,21.33 26.5,14.25 28.12,14.25 28.41,14.54 C3.1
  Top 0.305: D1.C 29.28,21.44 | X1.2 11.97,10.38 v11.94,10.41
  Top 0.61: 28.63,22.09 29.28,21.44 | 28.36,21.26 D1.C
  Bottom 0.254: v11.94,10.41 11.94,16.81 13.25,18.12 13.25,20.62 13.72,21.08 14.73,21.08 v14.98,21.33
  Bottom 0.305: D2.C 29.88,20.5 v30.62,21.25
  pour Top: 27.62,17.75 27.62,25.12 27.88,25.38 31.38,25.38 31.5,25.25 31.62,20.75 31.25,20.38 29.88,20.38 29.25,19.38 29.25,15.62 27.75,15.62
PWR_ON
  Bottom 0.305: 6.67,36.06 BTN.1 7.73,35 J1.PWRON
UART_RX  (via drill 0.8)
  Bottom 0.254: J1.UART1-RX 35.75,42.92 35.75,33.12 36.2,32.67 37.9,32.67 v38,32.57
UART_TX  (via drill 0.8)
  Bottom 0.22: 38,44.08 39,43.08 | 39,42.38 38,41.38
  Bottom 0.254: J1.UART1-TX 38,45.37 38,44.08 | 39,43.08 39,42.38 | 38,41.38 v38,35.11
VBAT_EXT
  Bottom 0.305: J1.BAT 4.62,40.66 25.34,40.66 26.5,39.5 26.5,35.25 27,34.75 29.89,34.75 SJ1.3 31.41,34.66 31.5,34.75 31.5,35.75 34.25,38.5 34.25,47.78 VBAT.1
VCC3V3  (via drill 0.3)
  Top 0.305: J1.VCC3V3 2.58,42.67 5.59,42.67 6.1,42.16 6.1,41.22 C9.1 6.33,33.03 6.6,32.77 8.38,32.77 8.64,32.51 8.64,32.12 | 8.38,30.54 R12.2 | R12.2 8.86,30.48 13.46,30.48 13.72,30.23 13.72,28.7 13.97,28.45 16.26,28.45 16.76,27.94 v16.76,23.88 | 8.64,32.12 8.64,30.29 R12.2 | v9.12,32.12 8.64,32.12 | 9.46,37.21 C12.2 | PAM1.6 9.97,34.67 C15.1 9.33,35.56 C12.2 | PAM1.4 11.79,37.08 C12.2 | v9.12,38.88 9.12,37.29 C12.2 | v15.5,37.5 16,37.5 16.25,37.25 | 16.29,37.21 16.25,37.25 | 16.25,37.25 18.02,37.25 PAM1.13 20.77,37.21 C11.2
  Top 0.406: PAM1.5 9.33,35.94 9.33,35.56
  Bottom 0.305: SDIO.4 22.69,17.19 21.59,18.29 17.27,18.29 16.76,18.8 v16.76,23.88 | v9.12,32.12 10,33 17.25,33 18,33.75 SJ3.3 SJ3.2 v15.5,37.5 10.5,37.5 v9.12,38.88
VCC5V  (via drill 0.3)
  Top 0.305: J1.VCC5V@1 38.1,47.83 38.1,46.23 37.38,45.5 35.85,45.5 35.1,44.75 v35,44.75 34.95,44.7 26.09,44.7 24.31,42.93 24.25,42.93 | 24.25,42.93 22.27,42.93 | 22.27,42.93 C10.1 | C7.1 24.31,42.86 24.25,42.93 | 22.27,42.93 21.05,42.93 20.5,42.38 20.5,40 v20.88,39.62
  Top 0.61: 22.34,30.11 22.35,31.63
  Top 0.813: v25.65,30.23 25.91,30.48
  Bottom 0.254: 35.05,38.05 35.12,38.12
  Bottom 0.305: 35.05,38.05 32.25,35.25 32.25,32.25 31.75,31.75 30.11,31.75 SJ1.1 | v26.92,32.77 27.3,33.14 SJ1.2 SJ1.1 | v35,44.75 35.12,44.62 35.12,38.12 | v20.88,39.62 20.27,39.02 SJ3.1 | SJ2.3 30,31.6 SJ1.1
  Bottom 0.813: L2.P$2 25.4,29.97 v25.65,30.23
  pour Top: 28.88,36.75 26.75,36.75 26,36 26,33.88 24.62,32.5 21.12,32.5 19.5,30.88 19.5,29.12 22.12,29.12 25.38,29.12 27.25,31 28.88,31 28.88,36.25
VREG_OUTPUT  (via drill 0.3)
  Top 0.305: v24,21 24.25,21.25 D1.A
  Bottom 0.305: D2.A 24.5,20.5 v24,21
  Bottom 0.813: L2.P$1 22.35,25.76 v23.11,25
  pour Top: 19.38,27.62 25.25,27.62 27.5,29.88 28.25,29.88 28.25,28.25 26.88,26.75 25.88,25.62 25.88,21.25 25.62,21 24,21 23.88,21.12 23.88,22.38 23.75,22.38 20.5,25.62 19.38,25.62
VSYNC  (via drill 0.3)
  Top 0.305: X1.33 27.47,7.07 v28.19,6.35
  Bottom 0.305: J1.LCD-VSYNC 2.46,4.57 10.16,4.57 11.68,3.05 25.4,3.05 26.16,3.81 27.94,3.81 28.19,4.06 v28.19,6.35

### Text on the board
tNames: Tzatziffy II | 1 | 40 | v6 / JKW
bNames: CHRIN | L- | L+ | R- | R+ | Lo | Li | Ro | Ri | G | BGND | VBAT | B | A | A:3v3 / B:5v / C:Bat | DC/DC | C | B | Amp | A | CHIPDIPSHOP | Tzatziffy II